# EAGLE design TinyTrackuino (EAGLE 6.5.0)
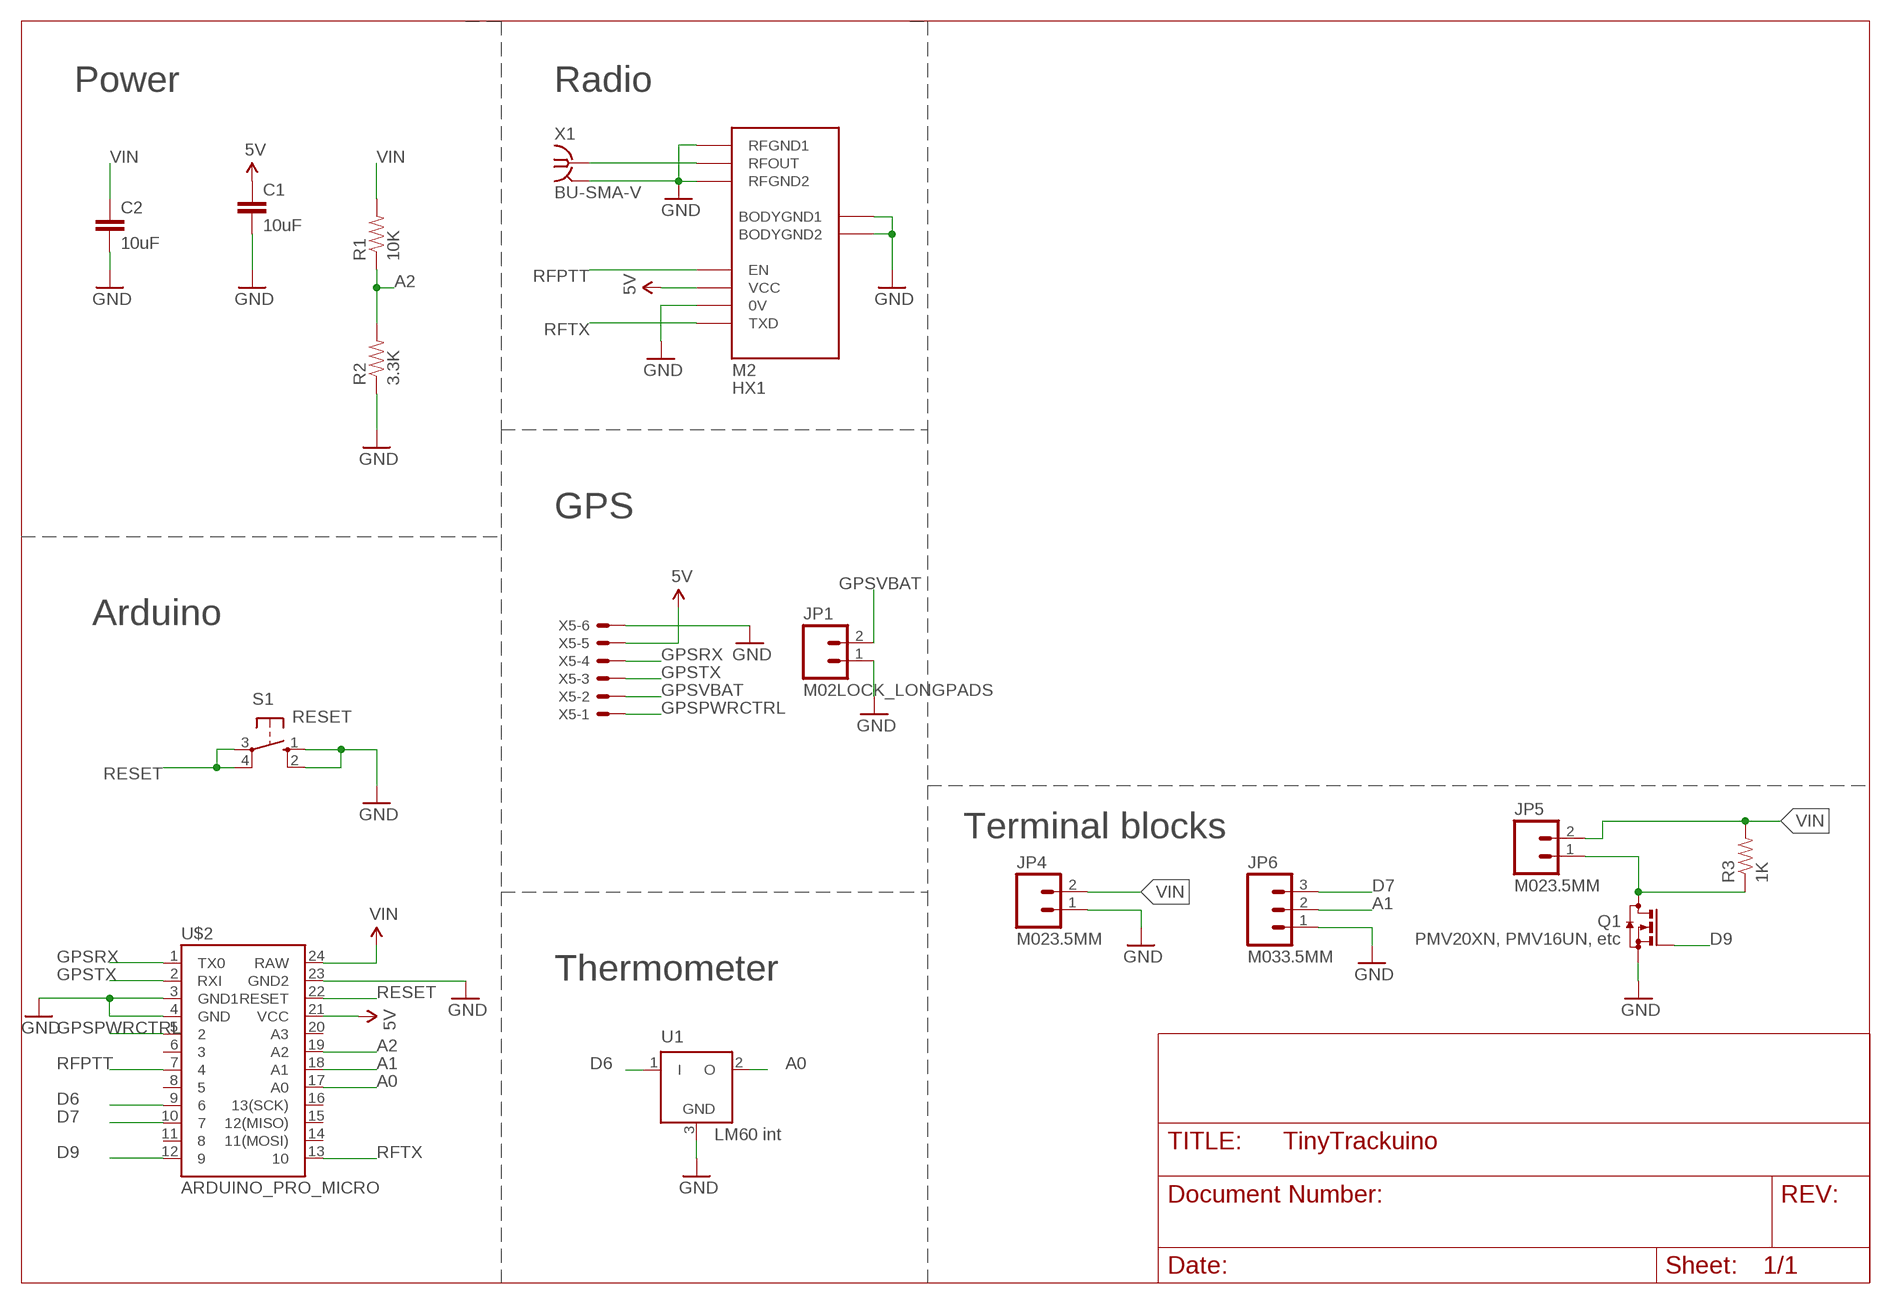
[diagram p0: schematic, sheet 1]

## Parts
C1  10uF  CAP1206  [1206]
C2  10uF  CAP1206  [1206]
JP1  M02LOCK_LONGPADS  [1X02_LOCK_LONGPADS]
JP4  M023.5MM  [SCREWTERMINAL-3.5MM-2]
JP5  M023.5MM  [SCREWTERMINAL-3.5MM-2]
JP6  M033.5MM  M03SCREW  [SCREWTERMINAL-3.5MM-3]
M2  HX1  [HX1]
Q1  PMV20XN, PMV16UN, etc  BSS123  [SOT23]
R1  10K  RESISTOR0603-RES  [0603-RES]
R2  3.3K  RESISTOR0603-RES  [0603-RES]
R3  1K  RESISTOR0603-RES  [0603-RES]
S1  RESET  10-XX  [B3F-10XX]
U1  LM60 int  LM60  [TO92]
U$2  ARDUINO_PRO_MICRO  [ARDUINO_PRO_MICRO]
X1  BU-SMA-V  [BU-SMA-V]
X5  SM06B-SRSS-TB  [SM06B-SRSS-TB]

## Nets
5V: C1.1 M2.VCC U$2.21(VCC) X5.5
A0: U1.2(O) U$2.17(A0)
A1: JP6.2 U$2.18(A1)
A2: R1.1 R2.2 U$2.19(A2)
D6: U1.1(I) U$2.9
D7: JP6.3 U$2.10
D9: Q1.1(G) U$2.12
GND: C1.2 C2.2 JP1.1 JP4.1 JP6.1 M2.0V M2.BODYGND1 M2.BODYGND2 M2.RFGND1 M2.RFGND2 Q1.2(S) R2.1 S1.1(S) S1.2(S1) U1.3(GND) U$2.3(GND1) U$2.4(GND) U$2.23(GND2) X1.2(GND) X5.6
GPSPWRCTRL: U$2.5 X5.1
GPSRX: U$2.1(TX0) X5.4
GPSTX: U$2.2(RXI) X5.3
GPSVBAT: JP1.2 X5.2
N$1: JP5.1 Q1.3(D) R3.1
RESET: S1.3(P) S1.4(P1) U$2.22(RESET)
RFOUT [20]: M2.RFOUT X1.1
RFPTT: M2.EN U$2.7
RFTX: M2.TXD U$2.13
VIN: C2.1 JP4.2 JP5.2 R1.2 R3.2 U$2.24(RAW)
Unconnected: U$2.6 U$2.8 U$2.11 U$2.14(11(MOSI)) U$2.15(12(MISO)) U$2.16(13(SCK)) U$2.20(A3)

## Notes on the sheet
- Power | Radio
- GPS
- Arduino
- Terminal blocks
- Thermometer

## Power pins joined to a net without a drawn wire
GND: X1.3(GND) X1.4(GND) X1.5(GND)

## Library data of the parts
C1 C2 = SparkFun-Passives:CAP: Capacitor Standard 0603 ceramic capacitor, and 0.1" leaded capacitor.
JP1 JP4 JP5 = SparkFun-Connectors:M02: Standard 2-pin 0.1" header. Use with - straight break away headers ( PRT-00116) - right angle break away headers (PRT-00553) - swiss pins (PRT-00743) - machine pins (PRT-00117) - female headers (PRT-00115) Molex polarized connector foot print use with: PRT-08233 with associated crimp pins and housings. 2.54_SCREWTERM for use with PRT-10571. 3.5mm Screw Terminal footprints for PRT-08084 5mm Screw Terminal footprints for use with PRT-08433
JP6 = SparkFun-Connectors:M03: Header 3 Standard 3-pin 0.1" header. Use with straight break away headers (SKU : PRT-00116), right angle break away headers (PRT-00553), swiss pins (PRT-00743), machine pins (PRT-00117), and female headers (PRT-00115). Molex polarized connector foot print use with SKU : PRT-08232 with associated crimp pins and housings.
M2 = trackuino:HX1
Q1 = transistor-small-signal:BSS123: N-CHANNEL MOS FET
R1-R3 = SparkFun-Passives:RESISTOR: Resistor Basic schematic elements and footprints for 0603, 1206, and PTH resistors.
S1 = switch-omron:10-XX: OMRON SWITCH
U1 = trackuino:LM60
U$2 = SparkFun-Boards:ARDUINO_PRO_MICRO
X1 = con-coax:BU-SMA-V: FEMALE SMA CONNECTOR Radiall distributor RS 112-3794; OC_FARNELL: unknown; OC_NEWARK: unknown
X5 = con-jst2:?M06B-SRSS-TB: Disconnectable Crimp style connector, 1.0mm pitch 6 contacts

## Net classes
0 10: width 0.254 mm
1 15: width 0.381 mm
2 20: width 0.508 mm
3 30: width 0.762 mm
4 40: width 1.016 mm
5 50: width 1.27 mm
6 HIGH Current: width 2.54 mm

## Board
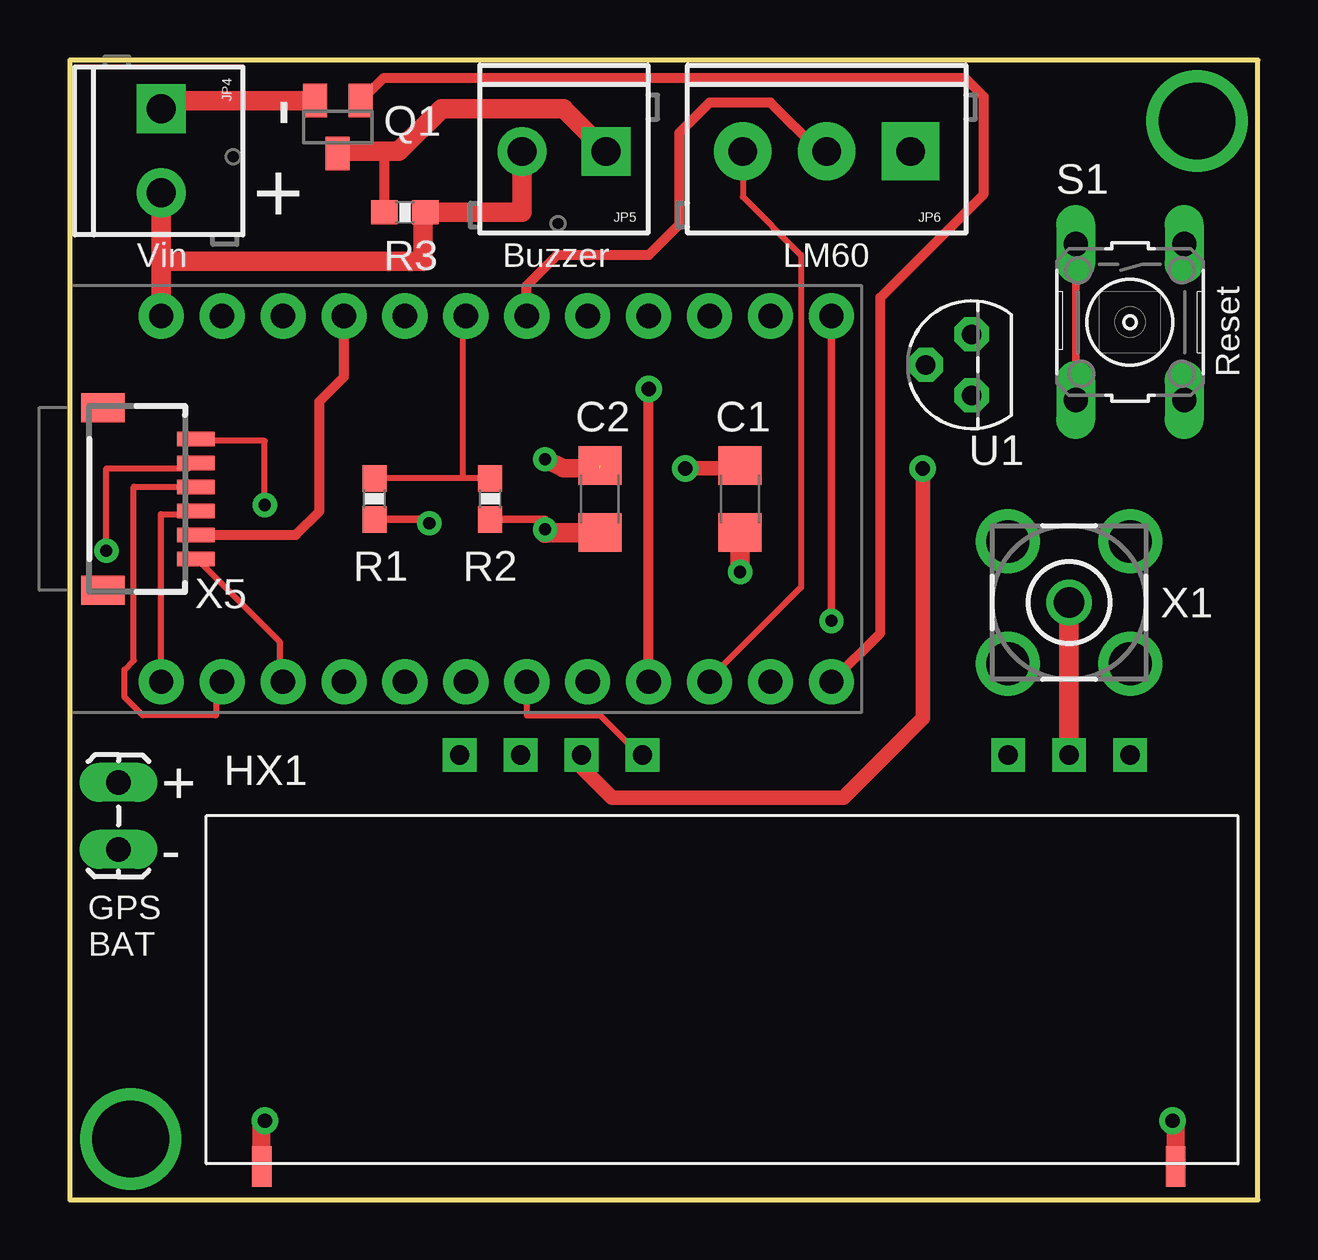
[diagram p1: board, top side]
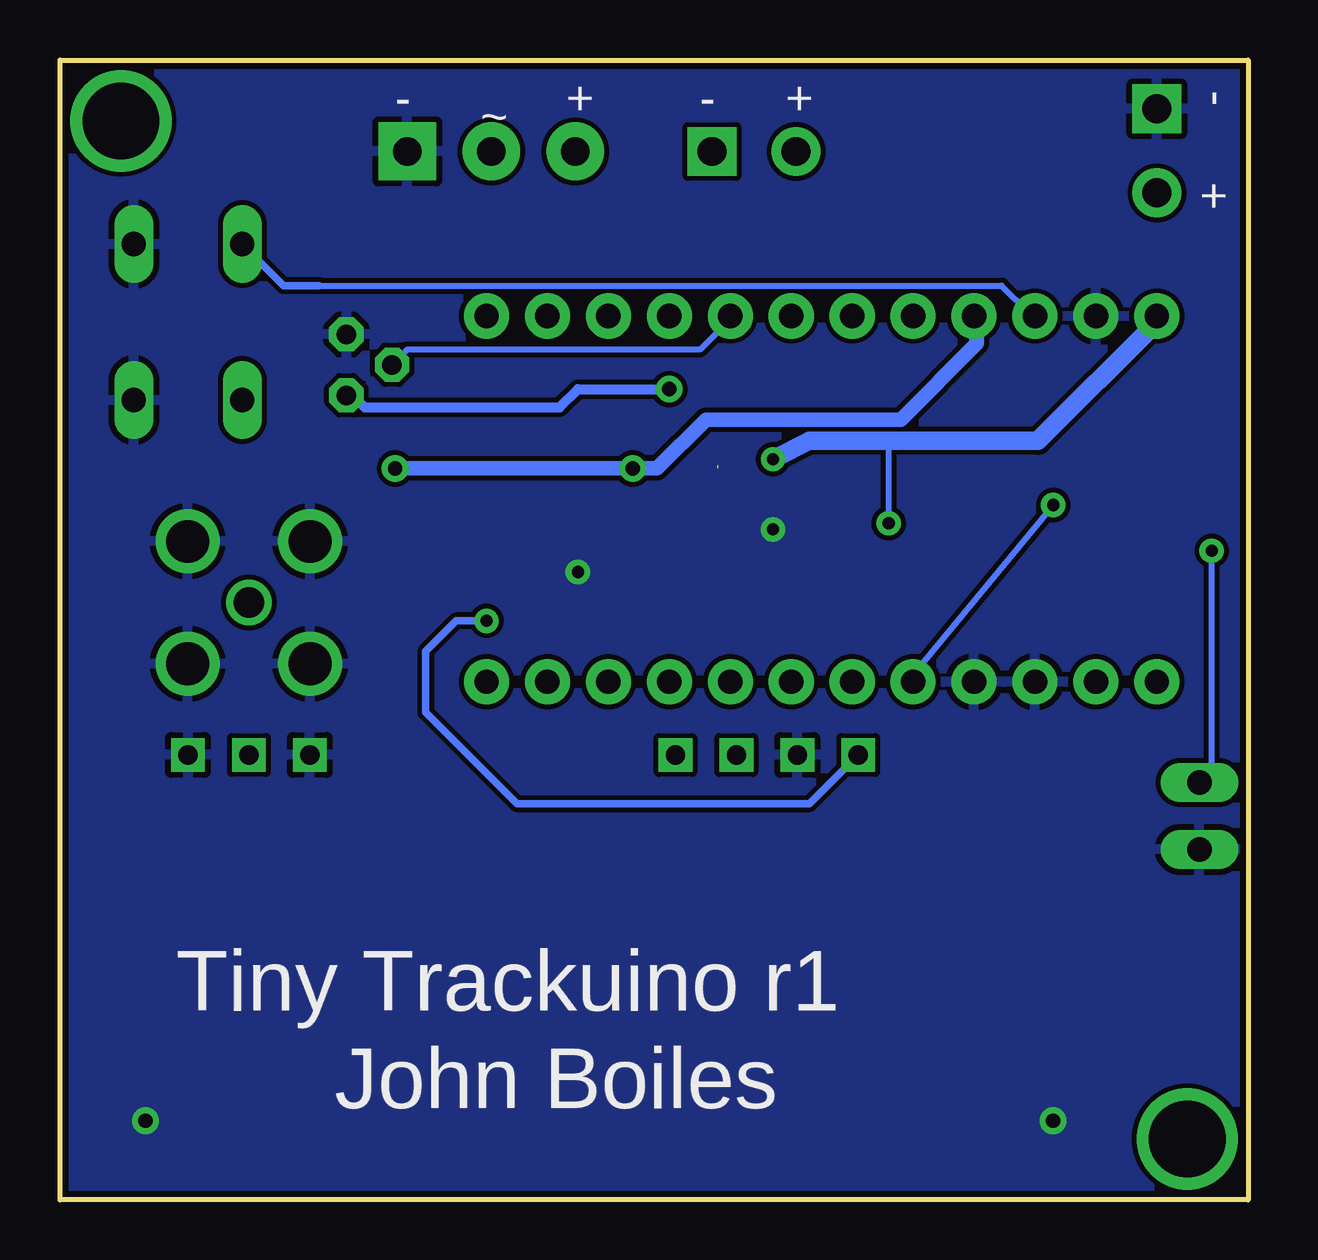
[diagram p2: board, bottom side, seen from below]

Size 49.53 x 47.5 mm. Coordinates in mm from the lower left corner, seen from the top.
Outline: 49.53,47.5 0,47.5 0,0 49.53,0 49.53,47.5
Copper layers (1*16): Top 0.035mm / dielectric 1.5mm / Bottom 0.035mm
Design rules "SparkFun": minimum track width 8mil, minimum drill 20mil, track to track 8mil, track to pad 8mil, pad to pad 8mil, via to via 8mil, smd to smd 8mil, copper to edge 10mil, drill to drill 8mil, minimum pad ring 12mil, minimum via ring 10mil, stop-mask expansion 4mil, vias tented up to drill 25mil, thermal gap 10mil

### Footprints (pad centres in the part's own frame; a part is rotated, then mirrored left to right if it is on the bottom)
1206 = smd 1.6 x 1.8: 1 -1.4,0; 2 1.4,0
1X02_LOCK_LONGPADS = drill 1.016 long: 1 -0.127,0; 2 2.667,0
SCREWTERMINAL-3.5MM-2 = drill 1.2 pad 2.032 square: 1 0,0 | drill 1.2 pad 2.032: 2 3.5,0
SCREWTERMINAL-3.5MM-3 = drill 1.2 pad 2.413 square: 1 0,0 | drill 1.2 pad 2.413: 2 3.5,0; 3 7,0
HX1 = drill 0.8 square: 0V 25.4,-8.89; EN 20.32,-8.89; RFGND1 0,-8.89; RFGND2 5.08,-8.89; RFOUT 2.54,-8.89; TXD 27.94,-8.89; VCC 22.86,-8.89 | smd 0.813 x 1.676: BODYGND1 -1.905,8.255; BODYGND2 36.195,8.255
SOT23 = smd 1 x 1.4: 1 -0.95,-1.1; 2 0.95,-1.1; 3 0,1.1
0603-RES = smd 1.1 x 1: 1 -0.85,0; 2 0.85,0
B3F-10XX = drill 1.016 long: 1 -3.251,2.261; 2 3.251,2.261; 3 -3.251,-2.261; 4 3.251,-2.261
TO92 = drill 0.813 octagon: 1 -1.27,0; 2 0,1.905; 3 1.27,0
ARDUINO_PRO_MICRO = drill 1.016 pad 1.88: 1 -7.62,12.7; 2 -7.62,10.16; 3 -7.62,7.62; 4 -7.62,5.08; 5 -7.62,2.54; 6 -7.62,0; 7 -7.62,-2.54; 8 -7.62,-5.08; 9 -7.62,-7.62; 10 -7.62,-10.16; 11 -7.62,-12.7; 12 -7.62,-15.24; 13 7.62,-15.24; 14 7.62,-12.7; 15 7.62,-10.16; 16 7.62,-7.62; 17 7.62,-5.08; 18 7.62,-2.54; 19 7.62,0; 20 7.62,2.54; 21 7.62,5.08; 22 7.62,7.62; 23 7.62,10.16; 24 7.62,12.7
BU-SMA-V = drill 1.27: 1 0,0 | drill 1.778: 2 -2.55,2.55; 3 2.55,2.55; 4 2.55,-2.55; 5 -2.55,-2.55
SM06B-SRSS-TB = smd 0.6 x 1.55: 1 -2.5,2.975; 2 -1.5,2.975; 3 -0.5,2.975; 4 0.5,2.975; 5 1.5,2.975; 6 2.5,2.975 | smd 1.2 x 1.8: FIT@1 -3.8,-0.9; FIT@2 3.8,-0.9

### Placement (x,y rotation side)
C1  27.94,29.21 270 top
C2  22.1,29.21 270 top
JP1  2.03,14.73 90 top
JP4  3.81,45.47 270 top
JP5  22.35,43.69 180 top
JP6  35.05,43.69 180 top
M2  44.2,9.65 180 top
Q1  11.18,44.7 180 top
R1  12.7,29.21 270 top
R2  17.53,29.21 90 top
R3  13.97,41.15 0 top
S1  44.2,36.58 270 top
U1  37.59,34.8 90 top
U$2  16.51,29.21 90 top
X1  41.66,24.89 0 top
X5  2.29,29.21 270 top

### Tracks (layer width: path | path; a pad name or v marks a point on that pad's centre or on a via)
5V  (via drill 0.6)
  Top 0.406: X5.5 9.42,27.71 10.41,28.7 10.41,33.27 11.43,34.29 U$2.21
  Top 0.61: M2.VCC 21.34,18.03 22.61,16.76 32.26,16.76 35.56,20.07 v35.56,30.48 | v25.65,30.48 27.94,30.48 C1.1
  Bottom 0.254: 11.43,36.58 11.81,36.58 11.3,36.7 11.43,36.96 U$2.21
  Bottom 0.406: U$2.21 11.43,35.56
  Bottom 0.61: 11.3,36.7 11.3,35.69 14.48,32.51 22.61,32.51 24.64,30.48 v25.65,30.48 v35.56,30.48
A0
  Bottom 0.254: U1.2 35.05,35.43 22.86,35.43 21.72,36.58 U$2.17
A1
  Top 0.406: U$2.18 19.05,38.1 20.32,39.37 24.13,39.37 25.4,40.64 25.4,44.45 26.67,45.72 29.21,45.72 31.24,43.69 JP6.2
A2
  Top 0.254: 16.38,30.1 12.95,30.1 R1.1 | 16.38,30.1 17.53,30.1 R2.2 | 16.38,30.1 16.38,36.58 U$2.19
D6  (via drill 0.6)
  Top 0.406: U$2.9 v24.13,33.78
  Bottom 0.406: U1.1 37.34,33.53 36.83,33.02 28.7,33.02 27.94,33.78 v24.13,33.78
D7
  Top 0.254: U$2.10 26.67,21.72 30.48,25.53 30.48,39.37 28.05,41.8 JP6.3
D9
  Top 0.406: U$2.12 33.78,23.62 33.78,37.59 38.1,41.91 38.1,45.97 37.34,46.74 13.06,46.74 Q1.1
GND  (via drill 0.51, 0.6)
  Top 0.254: 8,1.52 M2.BODYGND2 | 2.29,14.48 JP1.1 | X5.6 5.33,26.67 8.76,23.24 8.76,21.72 U$2.3
  Top 0.305: R2.1 19.81,28.36 v19.81,27.94
  Top 0.75: 8,1.52 8,3.17 v8.13,3.3 | M2.BODYGND1 46.1,3.17 v45.97,3.3
  Top 0.813: 19.81,27.79 19.81,27.81 | C2.2 19.81,27.81 | 19.81,27.81 v19.81,27.94 | C1.2 v27.94,26.16 | Q1.2 3.81,45.8 JP4.1
  pour Bottom: 0,47.5 49.53,47.5 49.53,0 0,0
GPSPWRCTRL  (via drill 0.51)
  Top 0.254: v8.13,28.96 8.13,31.62 5.33,31.62 X5.1
  Bottom 0.254: v8.13,28.96 14.1,21.72 U$2.5
GPSRX
  Top 0.254: U$2.1 3.81,28.57 4.95,28.57 X5.4
GPSTX
  Top 0.254: 6.86,22.1 U$2.2 6.1,21.34 6.1,20.19 3.05,20.19 2.29,20.95 2.29,22.1 2.67,22.48 2.67,29.72 4.95,29.72 X5.3
GPSVBAT  (via drill 0.51)
  Top 0.254: v1.52,27.05 1.52,30.48 4.95,30.48 X5.2
  Bottom 0.254: v1.52,27.05 1.52,17.53 1.91,17.53 JP1.2
N$1
  Top 0.406: R3.1 13.12,43.6 13.21,43.69
  Top 0.813: Q1.3 11.18,43.69 13.21,43.69 13.72,43.69 15.49,45.47 20.57,45.47 JP5.1
N$3  (via drill 3.2)
  other vias: 2.54,2.54
N$4  (via drill 3.2)
  other vias: 46.99,44.96
RESET
  Top 0.305: S1.4 S1.3
  Bottom 0.254: 38.73,38.1 10.29,38.1 9.14,36.96 U$2.22
  Bottom 0.305: 38.73,38.1 40.21,38.1 S1.3
RFOUT
  Top 0.813: X1.1 M2.RFOUT
RFPTT
  Top 0.254: U$2.7 19.05,20.19 22.1,20.19 23.62,18.67 M2.EN
RFTX  (via drill 0.51)
  Top 0.305: U$2.13 v31.75,24.13
  Bottom 0.305: v31.75,24.13 33.02,24.13 34.29,22.86 34.29,20.32 30.48,16.51 18.29,16.51 M2.TXD
VIN  (via drill 0.51)  (1 unrouted)
  Top 0.254: 14.99,28.36 v14.99,28.19
  Top 0.305: 14.99,28.36 R1.2
  Top 0.762: 22.1,30.48 20.57,30.48 v19.81,30.86
  Top 0.813: U$2.24 3.81,39.12 | 3.81,39.12 JP4.2 | JP5.2 18.85,41.15 R3.2 14.73,41.15 14.73,39.12 3.81,39.12
  Bottom 0.254: v14.99,28.19 14.99,31.62
  Bottom 0.762: v19.81,30.86 18.29,31.62 14.99,31.62 8.76,31.62 3.81,36.58 U$2.24

### Text on the board
tNames: - | + | Vin | Buzzer | LM60 | Reset | C2 | C1 | + | - | GPS / BAT
bNames: - | + | - | + | - | ~ | + | Tiny Trackuino r1 | John Boiles